# EAGLE design k22a (EAGLE 6.5.0)

## Sheet 1 of 2
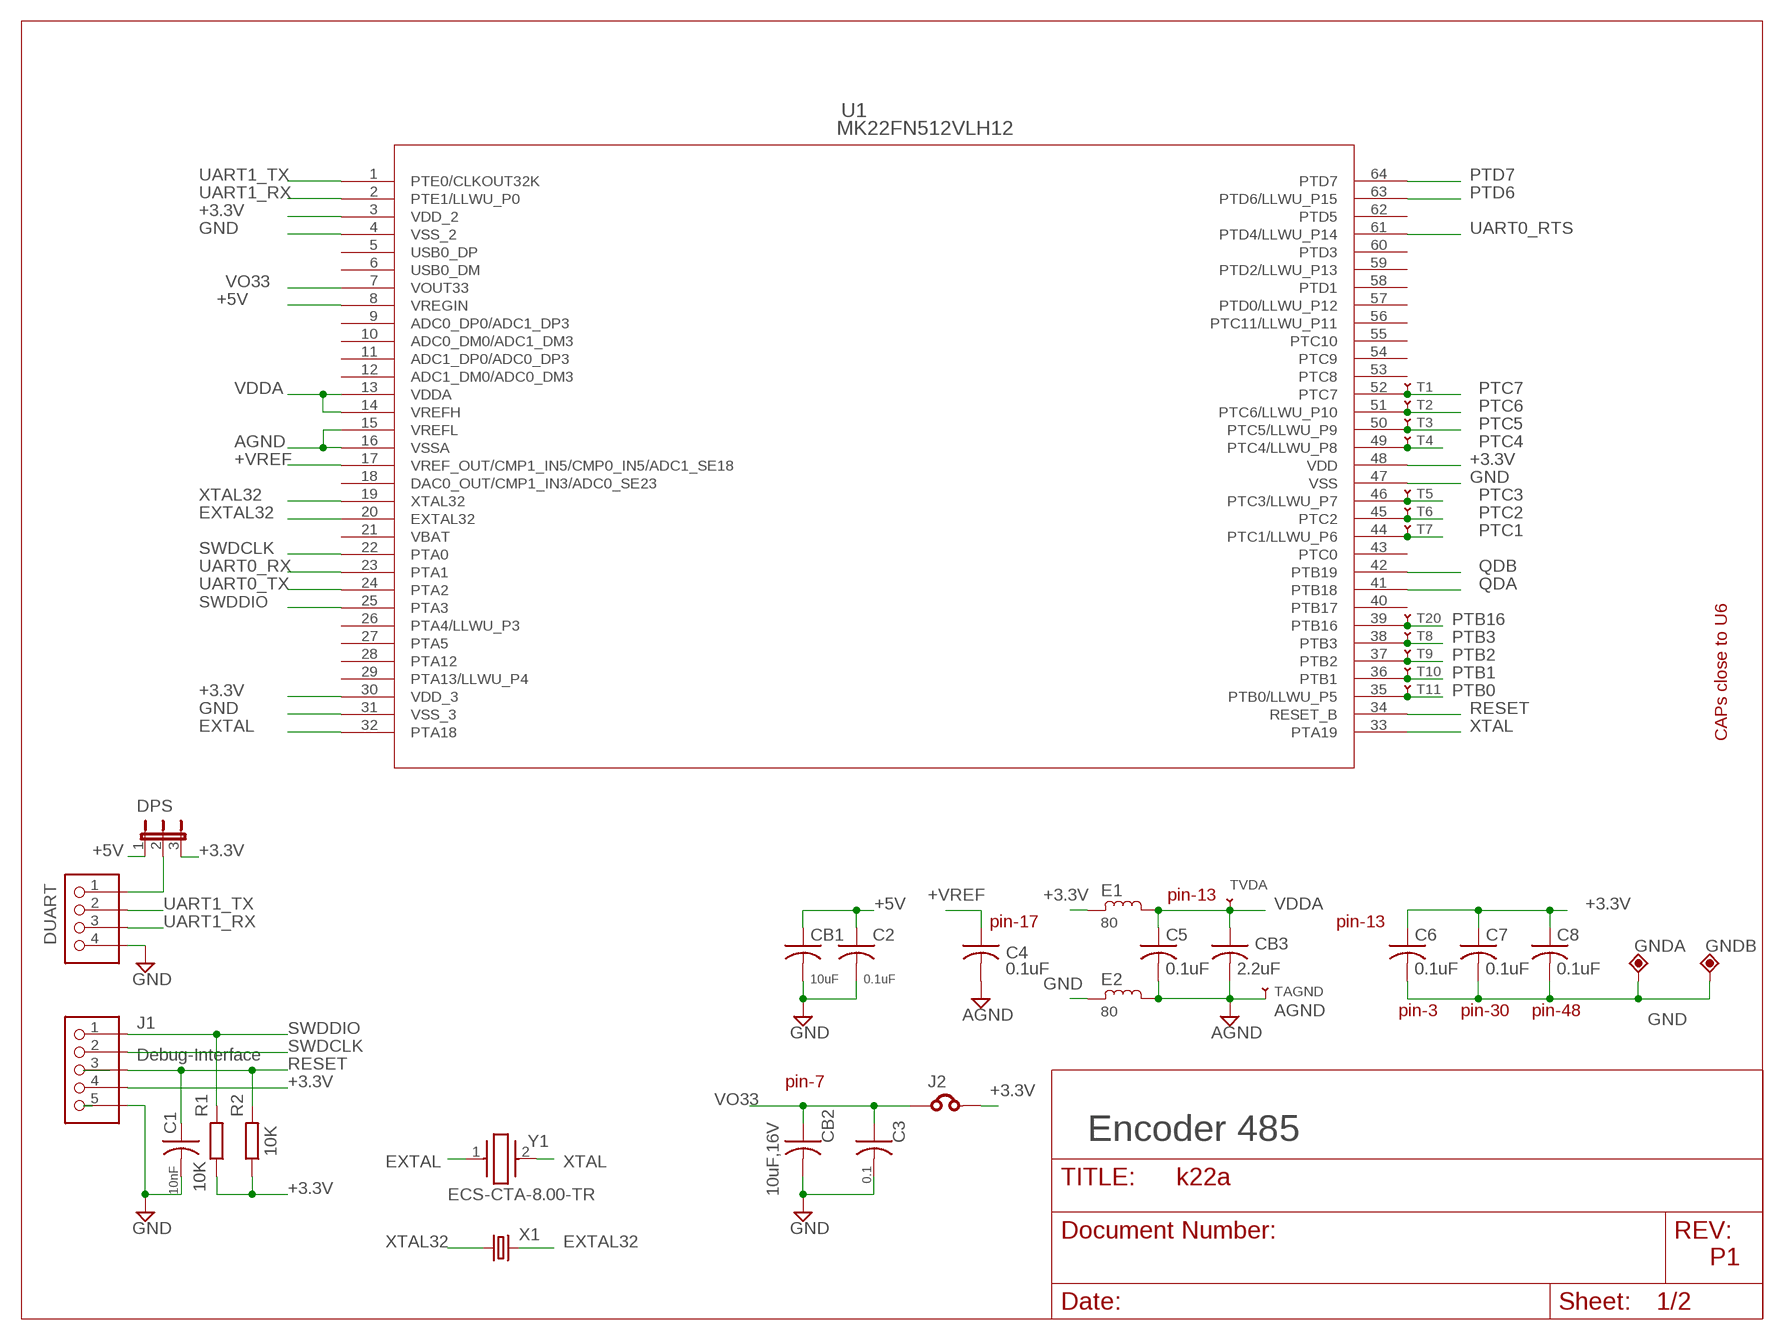
[diagram p0: schematic, sheet 1]

### Parts
C1  10nF  C-USC1206  [C1206]
C2  0.1uF  C-USC1206  [C1206]
C3  0.1  C-USC1206  [C1206]
C4  0.1uF  C-USC1206  [C1206]
C5  0.1uF  C-USC1206  [C1206]
C6  0.1uF  C-USC1206  [C1206]
C7  0.1uF  C-USC1206  [C1206]
C8  0.1uF  C-USC1206  [C1206]
CB1  10uF  C-USC1206  [C1206]
CB2  10uF,16V  C-USC1206  [C1206]
CB3  2.2uF  C-USC1206  [C1206]
DPS  JP2E-0805  [R0805/2]
DUART  PINHD-1X4  [1X4]
E1  80  ELDRC25SMD  [M1206]
E2  80  ELDRC25SMD  [M1206]
GNDA  TPP-PAD-032  [PAD-032]
GNDB  TPP-PAD-032  [PAD-032]
J1  PINHD-1X52MM  [1X5_2MM]
J2  J0805  [R0805]
R1  10K  R-EU_M1206  [M1206]
R2  10K  R-EU_M1206  [M1206]
T1  ATP-40  [ATP-40]
T2  ATP-40  [ATP-40]
T3  ATP-40  [ATP-40]
T4  ATP-40  [ATP-40]
T5  ATP-40  [ATP-40]
T6  ATP-40  [ATP-40]
T7  ATP-40  [ATP-40]
T8  ATP-40  [ATP-40]
T9  ATP-40  [ATP-40]
T10  ATP-40  [ATP-40]
T11  ATP-40  [ATP-40]
T20  ATP-40  [ATP-40]
TAGND  ATP-40  [ATP-40]
TVDA  ATP-40  [ATP-40]
U1  MK22FN512VLH12  [LQFP-64_10X10X1.6]
X1  CRYSTALTC26V  [TC26V@1]
Y1  ECS-CTA-8.00-TR  [ECSCTA800TR]

### Nets
+3.3V: C6.1 C7.1 C8.1 DPS.3 E1.1 J1.4 J2.2 R1.1 R2.1 U1.3(VDD_2) U1.30(VDD_3) U1.48(VDD) ; also sheet 2
+5V: C2.1 CB1.1 DPS.1 U1.8(VREGIN) ; also sheet 2
+VREF: C4.1 U1.17(VREF_OUT/CMP1_IN5/CMP0_IN5/ADC1_SE18)
AGND: C4.2 C5.2 CB3.2 E2.2 TAGND.P(TP) U1.15(VREFL) U1.16(VSSA)
EXTAL: U1.32(PTA18) Y1.1
EXTAL32: U1.20(EXTAL32) X1.2
GND: C1.2 C2.2 C3.2 C6.2 C7.2 C8.2 CB1.2 CB2.2 DUART.4 E2.1 GNDA.1(TP) GNDB.1(TP) J1.5 U1.4(VSS_2) U1.31(VSS_3) U1.47(VSS) ; also sheet 2
N$5: DPS.2 DUART.1
PTB0: T11.P(TP) U1.35(PTB0/LLWU_P5)
PTB1: T10.P(TP) U1.36(PTB1)
PTB2: T9.P(TP) U1.37(PTB2)
PTB3: T8.P(TP) U1.38(PTB3)
PTB16: T20.P(TP) U1.39(PTB16)
PTC1: T7.P(TP) U1.44(PTC1/LLWU_P6)
PTC2: T6.P(TP) U1.45(PTC2)
PTC3: T5.P(TP) U1.46(PTC3/LLWU_P7)
PTC4: T4.P(TP) U1.49(PTC4/LLWU_P8)
PTC5: T3.P(TP) U1.50(PTC5/LLWU_P9)
PTC6: T2.P(TP) U1.51(PTC6/LLWU_P10)
PTC7: T1.P(TP) U1.52(PTC7)
PTD6: U1.63(PTD6/LLWU_P15) ; also sheet 2
PTD7: U1.64(PTD7) ; also sheet 2
QDA: U1.41(PTB18) ; also sheet 2
QDB: U1.42(PTB19) ; also sheet 2
RESET: C1.1 J1.3 R2.2 U1.34(RESET_B) ; also sheet 2
SWDCLK: J1.2 U1.22(PTA0) ; also sheet 2
SWDDIO: J1.1 R1.2 U1.25(PTA3) ; also sheet 2
UART0_RTS: U1.61(PTD4/LLWU_P14) ; also sheet 2
UART0_RX: U1.23(PTA1) ; also sheet 2
UART0_TX: U1.24(PTA2) ; also sheet 2
UART1_RX: DUART.3 U1.2(PTE1/LLWU_P0)
UART1_TX: DUART.2 U1.1(PTE0/CLKOUT32K)
VDDA: C5.1 CB3.1 E1.2 TVDA.P(TP) U1.13(VDDA) U1.14(VREFH)
VO33: C3.1 CB2.1 J2.1 U1.7(VOUT33)
XTAL: U1.33(PTA19) Y1.2
XTAL32: U1.19(XTAL32) X1.1
Unconnected: U1.5(USB0_DP) U1.6(USB0_DM) U1.9(ADC0_DP0/ADC1_DP3) U1.10(ADC0_DM0/ADC1_DM3) U1.11(ADC1_DP0/ADC0_DP3) U1.12(ADC1_DM0/ADC0_DM3) U1.18(DAC0_OUT/CMP1_IN3/ADC0_SE23) U1.26(PTA4/LLWU_P3) U1.27(PTA5) U1.28(PTA12) U1.29(PTA13/LLWU_P4) U1.40(PTB17) U1.43(PTC0) U1.53(PTC8) U1.54(PTC9) U1.55(PTC10) U1.56(PTC11/LLWU_P11) U1.57(PTD0/LLWU_P12) U1.58(PTD1) U1.59(PTD2/LLWU_P13) U1.60(PTD3) U1.62(PTD5)

### Notes on the sheet
- CAPs close to U6
- pin-13
- pin-17 | pin-13
- pin-3 | pin-30 | pin-48
- Debug-Interface
- pin-7
- Encoder 485
- P1

## Sheet 2 of 2
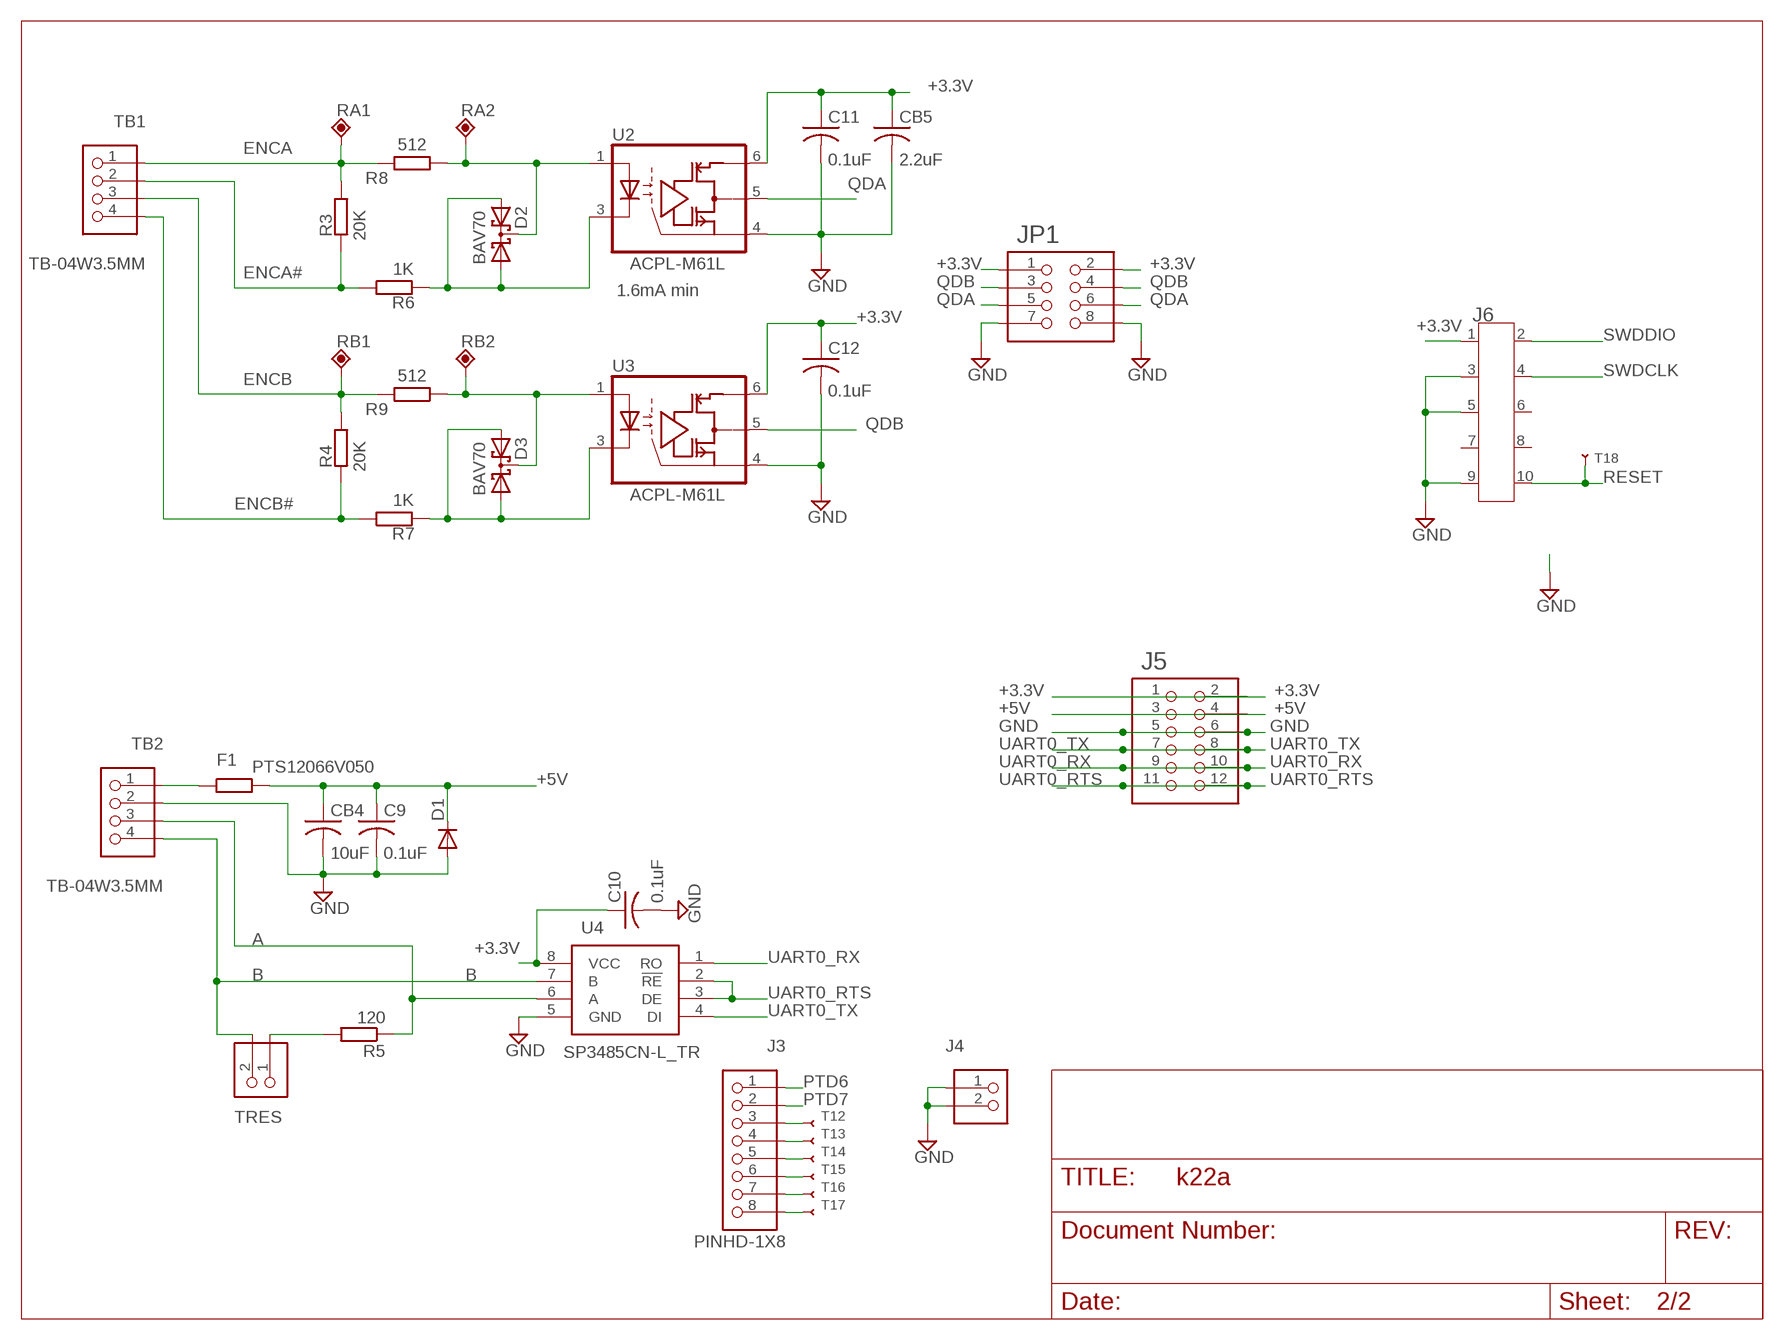
[diagram p1: schematic, sheet 2]

### Parts
C9  0.1uF  C-USC1206  [C1206]
C10  0.1uF  C-USC1206  [C1206]
C11  0.1uF  C-USC1206  [C1206]
C12  0.1uF  C-USC1206  [C1206]
CB4  10uF  C-USC1206  [C1206]
CB5  2.2uF  C-USC1206  [C1206]
D1  DIODE-DO214AC  [DO214AC]
D2  BAV70  BAS70-05  [SOT23]
D3  BAV70  BAS70-05  [SOT23]
F1  PTS12066V050  R-EU_R1206  [R1206]
J3  PINHD-1X8  [1X8]
J4  PINHD-1X2  [1X2]
J5  PINHD-2X6  [2X6]
J6  FTSH-105-01-L-DVMH  [CON10_2X5_FTSH_1]
JP1  PINHD-2X4  [2X4]
R3  20K  R-EU_M1206  [M1206]
R4  20K  R-EU_M1206  [M1206]
R5  120  R-EU_M0805  [M0805]
R6  1K  R-EU_M1206  [M1206]
R7  1K  R-EU_M1206  [M1206]
R8  512  R-EU_M1206  [M1206]
R9  512  R-EU_M1206  [M1206]
RA1  TPP-PAD-032  [PAD-032]
RA2  TPP-PAD-032  [PAD-032]
RB1  TPP-PAD-032  [PAD-032]
RB2  TPP-PAD-032  [PAD-032]
T12  ATP-40  [ATP-40]
T13  ATP-40  [ATP-40]
T14  ATP-40  [ATP-40]
T15  ATP-40  [ATP-40]
T16  ATP-40  [ATP-40]
T17  ATP-40  [ATP-40]
T18  ATP-40  [ATP-40]
TB1  TB-04W3.5MM  [WURTH35-04]
TB2  TB-04W3.5MM  [WURTH35-04]
TRES  PINHD-1X2  [1X2]
U2  ACPL-M61L  ACPL-M61LSO5  [SO-5]
U3  ACPL-M61L  ACPL-M61LSO5  [SO-5]
U4  SP3485CN-L_TR  [SOIC127P600X175-8N]

### Nets
+3.3V: C10.1 C11.1 C12.1 CB5.1 J5.1 J5.2 J6.1 JP1.1 JP1.2 U2.6(VCC) U3.6(VCC) U4.8(VCC) ; also sheet 1
+5V: C9.1 CB4.1 D1.C F1.2 J5.3 J5.4 ; also sheet 1
A: R5.1 TB2.3 U4.6(A)
B: TB2.4 TRES.2 U4.7(B)
ENCA: R3.1 R8.2 RA1.1(TP) TB1.1
ENCA#: R3.2 R6.1 TB1.2
ENCB: R4.1 R9.2 RB1.1(TP) TB1.3
ENCB#: R4.2 R7.1 TB1.4
GND: C9.2 C10.2 C11.2 C12.2 CB4.2 CB5.2 D1.A J4.1 J4.2 J5.5 J5.6 J6.3 J6.5 J6.9 JP1.7 JP1.8 TB2.2 U2.4(GND) U3.4(GND) U4.5(GND) ; also sheet 1
N$1: D3.3(C) R9.1 RB2.1(TP) U3.1(A)
N$2: D2.1(A1) D2.2(A2) R6.2 U2.3(C)
N$3: D2.3(C) R8.1 RA2.1(TP) U2.1(A)
N$4: D3.1(A1) D3.2(A2) R7.2 U3.3(C)
N$6: F1.1 TB2.1
N$8: J3.3 T12.P(TP)
N$9: J3.4 T13.P(TP)
N$10: J3.5 T14.P(TP)
N$11: R5.2 TRES.1
N$12: J3.6 T15.P(TP)
N$13: J3.7 T16.P(TP)
N$14: J3.8 T17.P(TP)
PTD6: J3.1 ; also sheet 1
PTD7: J3.2 ; also sheet 1
QDA: JP1.5 JP1.6 U2.5(OUT) ; also sheet 1
QDB: JP1.3 JP1.4 U3.5(OUT) ; also sheet 1
RESET: J6.10 T18.P(TP) ; also sheet 1
SWDCLK: J6.4 ; also sheet 1
SWDDIO: J6.2 ; also sheet 1
UART0_RTS: J5.11 J5.12 U4.2(!RE) U4.3(DE) ; also sheet 1
UART0_RX: J5.9 J5.10 U4.1(RO) ; also sheet 1
UART0_TX: J5.7 J5.8 U4.4(DI) ; also sheet 1
Unconnected: J6.6 J6.7 J6.8

### Notes on the sheet
- 1.6mA min

## Power pins joined to a net without a drawn wire
VBAT: U1.21(VBAT)

## Library data of the parts
C1-C12 CB1-CB5 = rcl:C-US: CAPACITOR, American symbol
D1 = diode:DIODE-: DIODE
D2 D3 = diode:BAS70-05: Silicon Schottky Diodes General-purpose diode for high-speed switching; PARTNO: BAV70-7-F
DPS = jumper:JP2E: JUMPER
DUART = stanley:PINHD-1X4
E1 E2 = stanley:ELDRC25
F1 R1-R4 R6-R9 = rcl:R-EU_: RESISTOR, European symbol
GNDA GNDB RA1 RA2 RB1 RB2 = testpoint:TPP: TEST POINT PAD
J1 = stanley:PINHD-1X5
J2 = jumper:J: Jumper/Bridge
J3 = stanley:PINHD-1X8
J4 TRES = stanley:PINHD-1X2
J5 = scia:PINHD-2X6
J6 = stanley:FTSH-105-01-L-DV: Use for minimum footprint (hot air flow)
JP1 = scia:PINHD-2X4
R5 = rcl:R-EU_: RESISTOR, European symbol; PARTNO: RC0805FR-072K7L
T1-T18 T20 TAGND TVDA = testpoint:ATP: AUTOMATED TEST POINT for automated bed of nails machinery; BOM: EXCLUDE
TB1 TB2 = stanley:TB-04
U1 = MK22FN512VHL12:MK22FN512VLH12; CPU: ARM Cortex-M4F; FLASHKB: 512; MANUFACTURER_PART_NUMBER: mk22fn512vlh12; MAXFREQUENCY: 120; PINCOUNT: 64; SRAMKB: 128; VENDOR: FREESCALE
U2 U3 = wcc:ACPL-M61L; PARTNO: ACPL-M61L-000E
U4 = SP3485CN-L_TR:SP3485CN-L_TR: RS-485 Interface IC 3.3V LoPwr Half-Dup RS485w/10Mbps Data Source: Datasheet <https://datasheet.datasheetarchive.com/originals/distributors/DKDS42/DSANUWW0043527.pdf>; ARROW_PART_NUMBER: SP3485CN-L/TR; ARROW_PRICE-STOCK: https://www.arrow.com/en/products/sp3485cn-ltr/maxlinear-inc?region=nac; DESCRIPTION: RS-485 Interface IC 3.3V LoPwr Half-Dup RS485w/10Mbps Data; HEIGHT: 1.75mm; MANUFACTURER_NAME: MaxLinear, Inc.; MANUFACTURER_PART_NUMBER: SP3485CN-L/TR; MOUSER_PART_NUMBER: 701-SP3485CN-L/TR; MOUSER_PRICE-STOCK: https://www.mouser.co.uk/ProductDetail/MaxLinear/SP3485CN-L-TR?qs=3EMgrMjM0fZL2ArUMUL9Gg%3D%3D
X1 = crystal:CRYSTAL: CRYSTAL; OC_FARNELL: unknown; OC_NEWARK: unknown
Y1 = ECS-CTA-8.00-TR:ECS-CTA-8.00-TR: 8 MHz Ceramic Resonator Without Capacitor +/-0.2% 30 Ohms -25C ~ 85C Surface Mount Source: Datasheet <https://ecsxtal.com/store/pdf/ECS-CTA.pdf>; DESCRIPTION: 8 MHz Ceramic Resonator Without Capacitor +/-0.2% 30 Ohms -25C ~ 85C Surface Mount; HEIGHT: 1.7mm; MANUFACTURER_NAME: ECS; MANUFACTURER_PART_NUMBER: ECS-CTA-8.00-TR

## Board
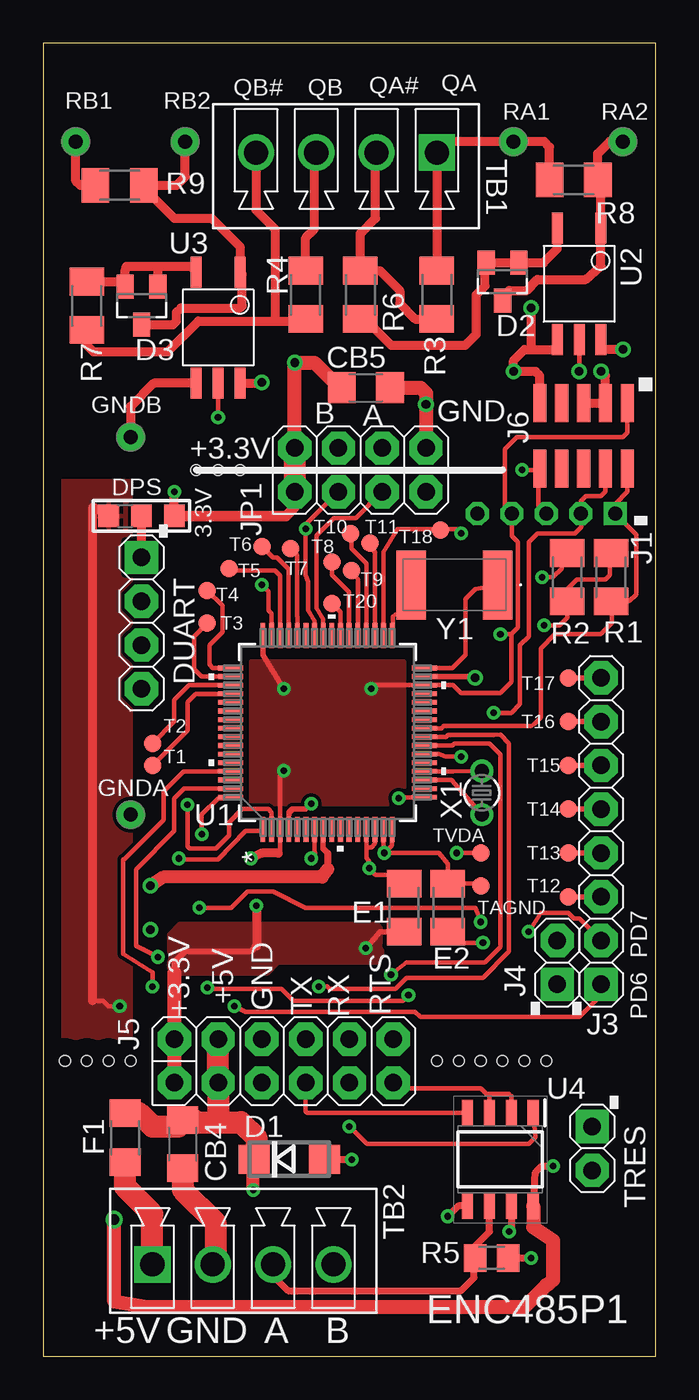
[diagram p2: board, top side]
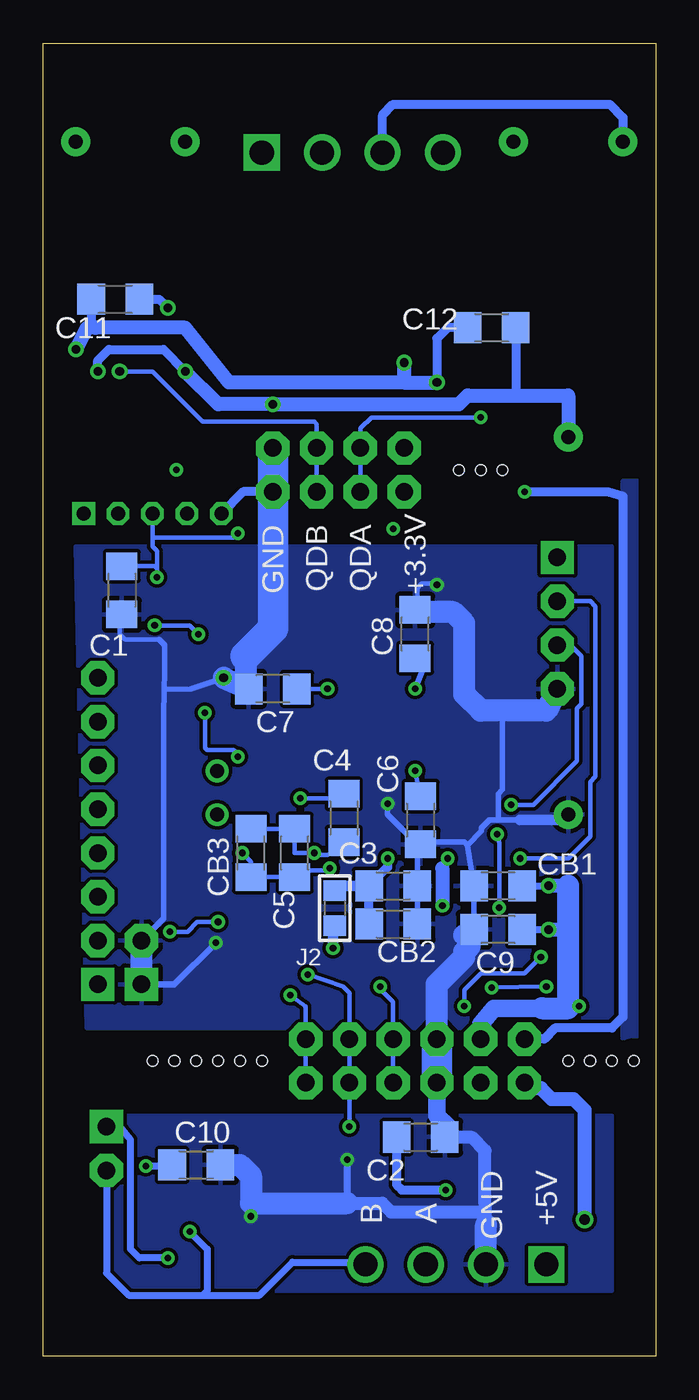
[diagram p3: board, bottom side, seen from below]

Size 35.56 x 76.2 mm. Coordinates in mm from the lower left corner, seen from the top.
Outline: 0,0 35.56,0 35.56,76.2 0,76.2 0,0
Copper layers (1*16): Top 0.035mm / dielectric 1.5mm / Bottom 0.035mm
Design rules "default *": minimum track width 10mil, minimum drill 15mil, track to track 8mil, track to pad 8mil, pad to pad 8mil, via to via 8mil, smd to smd 8mil, copper to edge 40mil, drill to drill 8mil, minimum pad ring 10mil, minimum via ring 8mil, stop-mask expansion 4mil, vias tented up to drill 0mil, thermal gap 10mil
Holes 0.6 mm at 5.08,17.14 3.81,17.14 2.54,17.14 1.27,17.14 22.86,17.14 24.13,17.14 25.4,17.14 26.67,17.14 27.94,17.14 29.21,17.14 10.16,51.44 11.43,51.44 8.89,51.44

### Footprints (pad centres in the part's own frame; a part is rotated, then mirrored left to right if it is on the bottom)
C1206 = smd 1.6 x 1.8: 1 -1.4,0; 2 1.4,0
DO214AC = smd 1.8 x 1.7: A 2.05,0; C -2.05,0
SOT23 = smd 1 x 1.4: 1 -0.95,-1.1; 2 0.95,-1.1; 3 0,1.1
R0805/2 = smd 1.2 x 1.3: 1 -1.905,0; 2 0,0; 3 1.905,0
1X4 = drill 1.016 pad 1.93 square: 1 -3.81,0 | drill 1.016 pad 1.93 octagon: 2 -1.27,0; 3 1.27,0; 4 3.81,0
M1206 = smd 1.6 x 2: 1 -1.4,0; 2 1.4,0
R1206 = smd 1.6 x 1.803: 1 -1.422,0; 2 1.422,0
PAD-032 = drill 0.813 pad 1.676: 1 0,0
1X5_2MM = drill 0.813 square: 1 -4,0 | drill 0.813 octagon: 2 -2,0; 3 0,0; 4 2,0; 5 4,0
R0805 = smd 1.2 x 1.3: 1 -1.016,0; 2 1.016,0
1X8 = drill 1.016 pad 1.93 square: 1 -8.89,0 | drill 1.016 pad 1.93 octagon: 2 -6.35,0; 3 -3.81,0; 4 -1.27,0; 5 1.27,0; 6 3.81,0; 7 6.35,0; 8 8.89,0
1X2 = drill 1.016 pad 1.93 square: 1 -1.27,0 | drill 1.016 pad 1.93 octagon: 2 1.27,0
2X6 = drill 1.016 pad 1.93 octagon: 1 -6.35,-1.27; 2 -6.35,1.27; 3 -3.81,-1.27; 4 -3.81,1.27; 5 -1.27,-1.27; 6 -1.27,1.27; 7 1.27,-1.27; 8 1.27,1.27; 9 3.81,-1.27; 10 3.81,1.27; 11 6.35,-1.27; 12 6.35,1.27
CON10_2X5_FTSH_1 = smd 0.762 x 2.2: 1 -2.54,-1.9; 2 -2.54,1.9; 3 -1.27,-1.9; 4 -1.27,1.9; 5 0,-1.9; 6 0,1.9; 7 1.27,-1.9; 8 1.27,1.9; 9 2.54,-1.9; 10 2.54,1.9
2X4 = drill 1.016 pad 1.93 octagon: 1 -3.81,-1.27; 2 -3.81,1.27; 3 -1.27,-1.27; 4 -1.27,1.27; 5 1.27,-1.27; 6 1.27,1.27; 7 3.81,-1.27; 8 3.81,1.27
M0805 = smd 1.3 x 1.6: 1 -0.95,0; 2 0.95,0
ATP-40 = smd 1.016 x 1.016: P 0,0
WURTH35-04 = drill 1.4 square: 1 -0.005,0 | drill 1.4: 2 3.5,0; 3 7,0; 4 10.5,0
LQFP-64_10X10X1.6 = smd 1.461 x 0.27: 1 -5.625,3.75; 2 -5.625,3.25; 3 -5.625,2.75; 4 -5.625,2.25; 5 -5.625,1.75; 6 -5.625,1.25; 7 -5.625,0.75; 8 -5.625,0.25; 9 -5.625,-0.25; 10 -5.625,-0.75; 11 -5.625,-1.25; 12 -5.625,-1.75; 13 -5.625,-2.25; 14 -5.625,-2.75; 15 -5.625,-3.25; 16 -5.625,-3.75; 33 5.625,-3.75; 34 5.625,-3.25; 35 5.625,-2.75; 36 5.625,-2.25; 37 5.625,-1.75; 38 5.625,-1.25; 39 5.625,-0.75; 40 5.625,-0.25; 41 5.625,0.25; 42 5.625,0.75; 43 5.625,1.25; 44 5.625,1.75; 45 5.625,2.25; 46 5.625,2.75; 47 5.625,3.25; 48 5.625,3.75 | smd 0.27 x 1.461: 17 -3.75,-5.625; 18 -3.25,-5.625; 19 -2.75,-5.625; 20 -2.25,-5.625; 21 -1.75,-5.625; 22 -1.25,-5.625; 23 -0.75,-5.625; 24 -0.25,-5.625; 25 0.25,-5.625; 26 0.75,-5.625; 27 1.25,-5.625; 28 1.75,-5.625; 29 2.25,-5.625; 30 2.75,-5.625; 31 3.25,-5.625; 32 3.75,-5.625; 49 3.75,5.625; 50 3.25,5.625; 51 2.75,5.625; 52 2.25,5.625; 53 1.75,5.625; 54 1.25,5.625; 55 0.75,5.625; 56 0.25,5.625; 57 -0.25,5.625; 58 -0.75,5.625; 59 -1.25,5.625; 60 -1.75,5.625; 61 -2.25,5.625; 62 -2.75,5.625; 63 -3.25,5.625; 64 -3.75,5.625
SO-5 = smd 1.803 x 0.635: 1 -3.226,1.27; 3 -3.226,-1.27; 4 3.226,-1.27; 5 3.226,0; 6 3.226,1.27
SOIC127P600X175-8N = smd 1.5 x 0.65: 1 -2.7,1.905; 2 -2.7,0.635; 3 -2.7,-0.635; 4 -2.7,-1.905; 5 2.7,-1.905; 6 2.7,-0.635; 7 2.7,0.635; 8 2.7,1.905
TC26V@1 = drill 0.813: 1 -1.27,0; 2 1.27,0
ECSCTA800TR = smd 1.7 x 4: 1 -2.5,0; 2 2.5,0

### Placement (x,y rotation side)
C1  30.99,44.45 270 bottom
C2  13.64,12.73 0 bottom
C3  15.24,27.3 0 bottom
C4  18.1,31.24 270 bottom
C5  20.95,29.21 90 bottom
C6  13.65,31.11 270 bottom
C7  22.23,38.73 180 bottom
C8  13.97,41.91 90 bottom
C9  9.14,24.77 180 bottom
C10  26.67,11.11 0 bottom
C11  31.37,61.34 0 bottom
C12  9.53,59.69 0 bottom
CB1  9.14,27.3 180 bottom
CB2  15.24,25.08 0 bottom
CB3  23.5,29.21 90 bottom
CB4  8.1,12.32 270 top
CB5  18.73,56.2 0 top
D1  14.29,11.43 0 top
D2  26.67,62.36 180 top
D3  5.71,60.96 180 top
DPS  5.71,48.77 0 top
DUART  5.71,42.55 270 top
E1  20.95,26.04 90 top
E2  23.5,26.04 90 top
F1  4.76,12.7 90 top
GNDA  5.08,31.43 0 top
GNDB  5.08,53.34 0 top
J1  29.21,48.9 180 top
J2  18.63,26.01 270 bottom
J3  32.38,30.48 90 top
J4  29.84,22.86 90 top
J5  13.97,17.14 0 top
J6  31.37,53.4 180 top
JP1  18.41,51.44 0 top
R1  32.96,45.21 270 top
R2  30.42,45.21 90 top
R3  22.86,61.59 270 top
R4  15.24,61.59 270 top
R5  26.04,5.71 0 top
R6  18.41,61.59 270 top
R7  2.54,60.96 90 top
R8  30.8,68.26 180 top
R9  4.45,67.94 180 top
RA1  27.3,70.48 0 top
RA2  33.66,70.48 0 top
RB1  1.91,70.48 0 top
RB2  8.26,70.48 0 top
T1  6.35,34.29 0 top
T2  6.35,35.56 0 top
T3  9.53,42.55 0 top
T4  9.53,44.45 0 top
T5  10.79,45.72 0 top
T6  12.7,46.99 0 top
T7  14.35,46.86 0 top
T8  16.76,46.1 0 top
T9  17.91,45.59 0 top
T10  17.84,47.75 0 top
T11  18.99,47.18 0 top
T12  30.48,26.67 0 top
T13  30.48,29.21 0 top
T14  30.48,31.75 0 top
T15  30.48,34.29 0 top
T16  30.48,36.83 0 top
T17  30.48,39.37 0 top
T18  23.05,47.94 0 top
T20  16.76,43.69 0 top
TAGND  25.4,27.3 0 top
TB1  22.86,69.85 180 top
TB2  6.35,5.33 0 top
TRES  31.88,12.06 270 top
TVDA  25.4,29.21 0 top
U1  16.51,36.2 90 top
U2  31.11,62.23 270 top
U3  10.16,59.69 270 top
U4  26.54,11.43 270 top
X1  25.46,32.7 90 top
Y1  23.88,44.77 180 top

### Tracks (layer width: path | path; a pad name or v marks a point on that pad's centre or on a via)
+3.3V  (via drill 0.38, 0.5, 0.6)
  Top 0.254: v19.05,38.73 19.26,38.95 U1.30 23.79,38.95 24.26,38.48 26.54,38.48 27.18,39.12 27.18,41.91 | v13.97,33.97 13.76,33.76 U1.3 13.76,29.32 13.65,29.21 | 27.18,41.91 27.56,42.29 27.56,47.24 27.21,47.59 J1.4 26.8,49.31 26.8,52.64 27.5,53.34 33.66,53.34 33.91,53.59 J6.1 | R1.1 32.89,46.55 32.89,45.34 32.64,45.09 30.99,45.09 30.42,44.51 R2.1 30.42,42.86 29.97,42.42 v29.08,42.42 | v26.54,41.91 27.18,41.91
  Top 0.305: U1.48 12.76,40.7 v13.97,38.73 | 12.38,23.81 12.06,23.5 8.26,23.5 7.62,22.86 7.62,22.23 | E1.1 19.55,24.64 v18.73,23.69
  Top 0.406: U4.8 28.57,10.67 28.96,11.05 v29.59,11.05
  Top 0.508: 13.65,29.21 12.7,29.21 v12.06,28.89 | v12.38,26.16 12.38,23.81 | DPS.3 v7.62,50.16 | v33.66,58.42 32.38,58.42 U2.6 | U3.6 12.65,56.46 v12.7,56.52
  Top 0.61: JP1.1 14.61,49.28 14.1,48.77 DPS.3
  Top 0.813: 7.62,22.23 J5.2 J5.1 | U4.8 28.45,7.49 29.59,6.73 29.59,4.45 29.34,4.19 29.21,4.13 27.94,2.86 6.03,2.86 4.13,3.17 v4.13,7.94 | JP1.2 v14.61,57.66 15.75,57.66 17.02,56.39 17.02,55.88 CB5.1
  Top 1.27: JP1.2 JP1.1
  Bottom 0.254: v19.05,38.73 C7.1 | v13.97,33.97 C6.1 | v29.08,42.42 27.05,42.42 v26.54,41.91
  Bottom 0.305: v13.97,38.73 13.46,40.01 C8.1 | 18.73,25.15 J2.2
  Bottom 0.406: v29.59,11.05 28.13,11.05 C10.1
  Bottom 0.508: v12.06,28.89 12.38,28.32 | v7.62,50.16 2.79,50.16 1.91,49.91 1.91,19.68 2.54,19.05 5.84,19.05 6.48,18.41 J5.2 | C11.1 32.77,59.69 32.52,59.69 32.51,59.69 | C12.1 12.06,59.69 12.7,59.05 v12.7,56.52
  Bottom 0.61: v18.73,23.69 18.73,25.15
  Bottom 0.813: v4.13,7.94 4.13,14.29 4.76,14.92 6.03,14.92 6.67,15.56 7.3,15.56 J5.1 | 12.38,28.32 v12.38,26.16 | v14.61,57.66 14.61,56.52 | 14.61,56.52 v12.7,56.52 | 14.61,56.52 24.77,56.52 27.3,59.69 32.51,59.69 33.02,59.69 v33.66,58.42
  pour Top: 12.06,40.32 20.95,40.32 20.95,32.07 12.06,32.07
  pour Top: 13.65,22.86 19.37,22.86 19.68,23.18 19.68,24.77 19.37,25.08 7.94,25.08 7.3,24.45 7.3,22.54 7.62,22.23 13.02,22.23
  pour Bottom: 0.64,50.8 1.91,50.8 1.91,18.41 0.64,18.41
+5V  (via drill 0.38, 0.5)
  Top 0.254: 2.86,20.64 3.49,20.64 3.81,20.32 v4.45,20.32
  Top 0.305: U1.8 16.26,29.46 16.51,29.21
  Top 0.406: 16.51,29.21 16.51,28.26
  Top 0.508: 2.86,20.64 2.86,49.21 2.92,49.28 DPS.1 | 12.19,11.38 D1.C
  Top 0.762: 16.51,28.26 16.19,27.81 6.99,27.81 v6.22,27.3 | v12.19,9.65 12.19,11.38
  Top 0.813: 7.85,13.34 CB4.1
  Top 1.27: CB4.1 8.76,13.72 8.89,13.59 10.16,13.59 | 10.16,13.59 11.49,13.59 12.38,12.7 12.38,11.57 D1.C | F1.2 5.56,14.12 6.35,13.34 7.85,13.34 | 10.16,13.59 J5.3 J5.4
  Bottom 0.254: 5.08,20.32 v4.45,20.32
  Bottom 0.406: CB1.1 v6.22,27.3 | C9.1 v6.22,24.77
  Bottom 0.508: C2.1 15.04,9.96 14.73,9.65 v12.19,9.65
  Bottom 0.813: 5.08,20.19 5.08,20.32 | v6.22,24.77 5.08,24.77 | 5.08,27.3 v6.22,27.3
  Bottom 1.016: J5.4 10.16,19.3 9.4,20.19 6.6,20.19
  Bottom 1.27: 6.6,20.19 5.08,20.19 | 5.08,20.32 5.08,24.77 5.08,27.3
  pour Top: 0.76,50.8 5.08,50.8 5.08,17.78 0.76,17.78 0.95,46.35
+VREF  (via drill 0.38)
  Top 0.254: U1.17 21.02,32.45 v20.64,32.38
  Bottom 0.254: v20.64,32.38 18.23,32.38 C4.1
A
  Top 0.406: TB2.3 13.35,4.68 14.22,3.81 24.26,3.81 25.02,4.57 25.02,5.65 R5.1 25.09,6.42 25.91,7.24 U4.6
AGND  (via drill 0.38)
  Top 0.254: U1.16 20.26,29.66 v19.81,29.21 | U1.15 19.76,29.16 v19.81,29.21 | v19.81,29.21 22.99,29.21 23.5,28.57 E2.2 25.27,27.43 TAGND.P
  Bottom 0.254: C4.2 19.05,29.08 19.43,29.08 19.56,29.21 v19.81,29.21 20.95,29.21 C5.2 CB3.2
B  (via drill 0.38)
  Top 0.406: U4.7 27.18,7.49 v27.05,7.24
  Bottom 0.406: TRES.2 31.88,4.83 30.61,3.56 26.29,3.56 | 26.29,3.56 22.99,3.56 21.08,5.46 16.98,5.46 TB2.4 | v27.05,7.24 26.04,6.22 26.04,3.81 26.29,3.56
ENCA
  Top 0.508: R8.2 29.4,70.17 29.08,70.48 RA1.1 23.5,70.48 TB1.1 R3.1
ENCA#
  Top 0.508: R3.2 21.59,60.2 20.7,61.09 20.7,61.85 19.55,62.99 R6.1 18.41,65.15 19.3,66.04 19.3,69.79 TB1.2
ENCB
  Top 0.508: R4.1 15.24,64.9 15.75,65.41 15.75,69.74 TB1.3 | R9.2 2.16,67.94 1.91,68.2 RB1.1
  Bottom 0.508: TB1.3 15.86,72.02 15.24,72.64 2.67,72.64 1.91,71.88 RB1.1
ENCB#
  Top 0.508: TB1.4 12.36,66.51 13.46,65.41 13.46,60.07 | R4.2 15.12,60.07 13.46,60.07 | R7.1 2.54,58.67 2.92,58.29 7.24,58.29 9.02,60.07 13.46,60.07
EXTAL
  Top 0.254: U1.32 23.75,39.95 24.51,40.7 24.51,43.94 25.08,44.51 Y1.1
EXTAL32
  Top 0.254: U1.20 23.79,33.95 X1.2
GND  (via drill 0.38, 0.5)
  Top 0.254: U1.4 14.26,31.41 14.29,31.43 | U1.47 13.26,43.1 13.08,43.28 13.08,44.39 v12.7,44.77 | v25.53,24 24.13,24 E2.1
  Top 0.305: U1.31 25.01,39.45 v25.08,39.37 | 14.29,31.43 14.29,31.56 14.48,31.75 15.24,31.75 v15.56,32.07
  Top 0.406: U4.5 24.1,8.73 v23.5,8.13 | D1.A v17.91,11.43
  Top 0.508: 28.32,58.42 27.94,58.42 27.3,57.78 v27.3,57.15 28.57,57.15 28.83,56.9 J6.9 | 28.32,58.42 29.84,58.42 U2.4 | v32.38,57.15 32.64,56.9 J6.3 J6.5 | v28.32,60.83 28.32,58.42 | U3.4 6.43,56.46 5.08,55.12 GNDB.1
  Top 0.813: CB5.2 21.91,56.2 22.23,55.88 v22.23,55.24 JP1.8
  Top 1.27: CB4.2 8.1,9.68 10,7.78 10,5.23 TB2.2
  Bottom 0.254: 13.84,43.18 13.84,44.58 13.59,44.83 12.76,44.83 v12.7,44.77 | 28.83,41.59 30.8,41.59 31.11,41.91 31.11,42.92 C1.2
  Bottom 0.305: J4.2 28.57,25.4 28.57,37.15 28.54,38.7 | 28.54,38.7 26.99,38.73 v25.08,39.37 | C6.2 13.84,29.71 15.56,31.43 v15.56,32.07 | 10.93,29.66 CB1.2 C9.2 11.11,24.58 11.11,24.45 | 10.93,29.66 11.11,29.84 13.52,29.84 C6.2 | 7.88,31.11 9.14,31.11 | 9.14,31.11 9.65,31.11 10.11,30.66 10.11,30.48 10.93,29.66 | 6.35,37.47 8.57,37.47 8.89,37.15 8.89,32.89 9.14,32.64 9.14,31.11 | 28.83,41.59 28.51,41.27 28.51,39.69 28.54,38.7 | CB2.2 C3.2 13.84,29.53 C6.2
  Bottom 0.381: v25.53,24 27.94,21.59 J4.1
  Bottom 0.406: v23.5,8.13 23.5,8.89 | v17.91,11.43 17.91,8.89
  Bottom 0.508: JP1.7 23.94,50.16 J1.5 | v32.38,57.15 32.38,57.78 31.75,58.42 28.57,58.42 v27.3,57.15 | C11.2 28.83,61.34 v28.32,60.83 | C12.2 8.12,55.76 8.13,55.75
  Bottom 0.61: 7.88,31.11 6.99,31.11 5.59,31.11 5.21,31.5 GNDA.1
  Bottom 0.762: 9.85,7.63 9.88,8.4 | 9.88,8.4 9.91,9.27 9.91,11.94 10.67,12.7 12.21,12.7 C2.2 | 17.91,8.89 15.88,8.89 15.37,8.38 9.89,8.38 9.88,8.4
  Bottom 0.813: v27.3,57.15 25.4,55.24 v22.23,55.24 11.43,55.24 10.92,55.75 8.13,55.75 5.08,55.75 GNDB.1
  Bottom 1.016: J5.5 12.7,13.97 12.06,13.34 12.06,12.9 C2.2
  Bottom 1.27: TB2.2 9.85,7.63 | 23.81,40.64 23.81,38.92 C7.2 v25.08,39.37 | DUART.4 6.35,37.47 10.16,37.47 11.11,38.42 11.11,42.55 11.75,43.18 13.84,43.18 C8.2 | J4.1 J4.2 | C10.2 24.13,11.11 23.5,10.48 23.5,8.89 17.91,8.89 | J5.6 12.7,21.59 11.11,23.18 11.11,23.5 10.79,23.81 10.79,24.13 11.11,24.45
  Bottom 1.778: J5.5 J5.6 | JP1.8 JP1.7 22.23,42.23 23.81,40.64
  pour Bottom: 33.66,46.99 33.02,19.05 2.54,19.05 2.54,46.99
  pour Bottom: 2.54,13.97 2.54,3.81 33.02,3.81 33.02,13.97
N$1
  Top 0.508: RB2.1 8.26,68.45 7.75,67.94 R9.1 5.84,67.81 7.62,66.04 9.78,66.04 11.43,64.39 U3.1 11.56,62.79 11.56,60.96 11.43,60.83 8,60.83 7.75,60.58 7.75,60.07 7.54,59.86 D3.3
N$2
  Top 0.508: U2.3 29.84,64.26 29.04,63.46 D2.1 D2.2 25.65,63.14 25.65,62.1 25.15,61.59 25.15,59.31 24.51,58.67 20.19,58.67 18.67,60.2 R6.2
N$3
  Top 0.508: D2.3 26.67,61.47 27.05,61.85 28.07,61.85 28.7,62.48 31.5,62.48 32.38,63.25 U2.1 32.38,68.08 R8.1 32.2,69.79 32.89,70.48 RA2.1
N$4
  Top 0.508: D3.1 6.67,63.18 | 6.67,63.18 6.73,63.25 8.56,63.25 U3.3 | D3.2 4.76,62.61 | 4.76,62.61 4.76,63.06 4.83,63.12 4.83,63.25 6.6,63.25 6.67,63.18 | R7.2 4.51,62.36 4.76,62.61
N$5
  Top 0.508: DUART.1 DPS.2
N$6
  Top 1.27: TB2.1 6.34,8.26 4.76,9.84 F1.1
N$8
  Top 0.305: T12.P J3.3
N$9
  Top 0.305: T13.P J3.4
N$10
  Top 0.305: T14.P J3.5
N$11  (via drill 0.38)
  Top 0.406: R5.2 27.37,5.65 27.5,5.65 27.56,5.71 v28.32,5.71
  Bottom 0.406: v28.32,5.71 29.97,5.71 30.48,6.22 30.48,12.57 31.11,13.34 TRES.1
N$12
  Top 0.305: T15.P J3.6
N$13
  Top 0.305: T16.P J3.7
N$14
  Top 0.305: T17.P J3.8
PTB0
  Top 0.254: U1.35 19.26,46.65 T11.P
PTB1
  Top 0.254: 17.91,47.43 T10.P 17.91,47.82 17.91,46.86 18.76,46.01 U1.36
PTB2
  Top 0.254: 17.91,45.47 T9.P 18.29,45.09 18.29,41.85 U1.37
PTB3
  Top 0.254: U1.38 17.76,44.34 16.76,45.34 T8.P
PTB16
  Top 0.254: U1.39 17.26,43.19 T20.P
PTC1
  Top 0.254: U1.44 14.76,42.9 14.73,42.93 14.73,46.48 T7.P
PTC2
  Top 0.254: U1.45 14.26,45.68 13.59,46.35 13.34,46.35 T6.P
PTC3
  Top 0.254: U1.46 13.76,45.3 13.46,45.59 10.92,45.59 T5.P
PTC4
  Top 0.254: U1.49 9.84,39.95 9.65,40.13 9.65,41.27 10.41,42.04 10.41,43.56 T4.P
PTC5
  Top 0.254: U1.50 9.2,39.45 8.76,39.88 8.76,41.78 T3.P
PTC6
  Top 0.254: U1.51 8.46,38.95 7.62,38.1 7.62,36.83 T2.P
PTC7
  Top 0.254: U1.52 8.85,38.45 8.38,37.97 8.38,36.32 T1.P
PTD6  (via drill 0.38)
  Top 0.254: J3.1 32.38,20.95 31.11,19.68 21.91,19.68 21.59,20 11.75,20 v11.11,20.32 | U1.63 8.18,32.95 7.62,32.38 7.62,30.48 5.4,28.26 5.4,23.81 v6.67,23.18
  Bottom 0.254: v11.11,20.32 11.11,21.27 10.16,22.23 7.62,22.23 v6.67,23.18
PTD7  (via drill 0.38)
  Top 0.254: J3.2 31.11,25.4 30.8,25.4 30.48,25.72 28.89,25.72 v28.19,24.64 | v25.4,25.21 25.08,26.04 15.24,26.04 13.34,26.99 11.87,26.99 10.92,26.04 v9.08,26.04 | U1.64 10.82,32.38 10.16,32.38 9.21,31.43 v9.21,30.29
  Bottom 0.254: v28.19,24.64 27.18,24.64 26.61,25.21 v25.4,25.21 | v9.08,26.04 9.08,29.78 v9.21,30.29
QDA  (via drill 0.5)
  Top 0.254: U1.41 16.26,42.8 15.88,43.43 15.88,47.62 16.89,48.64 18.16,48.64 JP1.5 | v31.11,57.15 U2.5
  Bottom 0.254: JP1.5 JP1.6 19.68,54.1 19.81,54.23 26.29,54.23 29.21,57.15 v31.11,57.15
QDB  (via drill 0.38, 0.38 pad 0.25)
  Top 0.254: U1.42 15.75,41.83 15.75,42.67 15.37,43.31 15.37,44.96 15.24,45.34 v15.24,48.01 15.24,48.26 JP1.3 | U3.5 v10.16,54.48
  Bottom 0.254: v10.16,54.48 16.51,54.48 17.14,53.85 JP1.4 JP1.3
RESET  (via drill 0.38)
  Top 0.254: 23.37,48.01 T18.P | v27.81,51.44 28.76,51.44 | 28.76,51.44 J6.10 | v24.26,47.75 24,48.01 23.5,48.01 T18.P | v28.95,45.22 29.59,45.22 30.1,45.72 30.1,46.35 30.35,46.61 R2.2 | 28.76,51.44 28.76,49.34 J1.3 | U1.34 19.76,46.68 20.57,48.01 22.99,48.01 T18.P
  Top 0.406: R2.2 29.97,46.61
  Bottom 0.254: v28.95,45.22 28.95,45.72 | 28.95,45.72 28.95,46.73 29.21,46.99 29.21,47.5 | J1.3 29.21,47.5 | 29.21,47.5 24.51,47.5 v24.26,47.75 | C1.1 29.08,45.85 28.95,45.72
SWDCLK  (via drill 0.38)
  Top 0.254: U1.22 22.97,34.95 23.37,34.8 v24.26,34.8 | J6.4 32.64,50.16 32.38,49.91 31.5,49.91 31.21,49.62 J1.2 31.24,48.86 31.24,48.13 30.86,47.75 28.7,47.75 28.19,47.24 28.19,41.78 27.69,41.27 27.69,37.85 27.18,37.34 v26.16,37.34
  Bottom 0.254: v24.26,34.8 24,34.67 24.51,35.18 26.04,35.18 26.16,35.31 v26.16,37.34
SWDDIO
  Top 0.254: U1.25 23.11,36.45 23.24,36.58 28.32,36.58 28.51,36.7 28.89,37.08 28.89,41.08 29.72,41.91 32.38,41.91 33.02,42.55 33.02,43.75 R1.2 34.04,43.81 34.42,44.2 34.42,47.69 J1.1 33.21,49.47 33.91,50.16 J6.2
UART0_RTS  (via drill 0.38)
  Top 0.254: U1.61 8.16,33.95 6.99,32.77 6.99,31.11 4.7,28.83 4.64,28.83 4.64,23.37 6.35,22.29 v6.35,21.46 | v21.21,20.95 20.89,20.64 14.54,20.64 13.84,21.34 9.59,21.34 v9.53,21.4 | U4.2 27.18,15.11 27.05,15.24 25.78,15.24 | 25.78,15.24 25.72,15.24 25.4,15.56 20.64,15.56 J5.11 | U4.3 25.91,15.11 25.78,15.24
  Bottom 0.254: v6.35,21.46 v9.53,21.4 | v21.21,20.95 20.32,20.32 J5.12 J5.11
UART0_RX  (via drill 0.38)
  Top 0.254: U1.23 23.76,35.45 23.88,35.56 25.91,35.56 26.54,34.92 26.54,23.75 25.65,22.86 21.08,22.86 v20.19,22.16 | U4.1 28.57,12.7 28.19,12.32 18.8,12.32 v17.78,13.34
  Bottom 0.254: v20.19,22.16 18.16,21.46 17.78,21.08 J5.10 J5.9 v17.78,13.34
UART0_TX  (via drill 0.38)
  Top 0.254: U1.24 23.37,35.95 23.5,36.07 26.16,36.07 26.54,36.07 27.05,35.56 27.05,23.5 25.53,21.97 21.08,21.97 20.45,21.34 16.64,21.34 16.51,21.46 v16,21.46 | U4.4 15.33,14.13 15.24,14.22 J5.7
  Bottom 0.254: v16,21.46 16,21.34 15.24,20.57 J5.8 J5.7
UART1_RX  (via drill 0.38)
  Top 0.254: U1.2 13.26,31.57 13.08,31.75 11.56,31.75 10.79,30.99 10.79,30.23 10.03,29.46 8.51,29.46 8.38,29.59 v8.38,32
  Bottom 0.254: v8.38,32 7.11,32 4.57,34.54 4.57,37.59 4.32,37.85 4.32,40.64 4.95,41.27 DUART.3
UART1_TX  (via drill 0.38)
  Top 0.254: U1.1 12.67,30.48 11.75,30.48 10.16,28.83 8.19,28.83 v7.87,28.89
  Bottom 0.254: DUART.2 3.81,43.81 3.49,43.5 3.49,33.66 3.81,33.34 3.81,30.16 5.08,28.89 v7.87,28.89
VDDA  (via drill 0.38)
  Top 0.254: U1.13 18.76,29.53 | 18.76,29.53 18.76,28.92 18.92,28.76 v18.92,28.32 19.3,27.94 20.07,27.94 20.57,27.43 E1.2 | U1.14 19.26,29.76 19.05,29.53 18.76,29.53 | v24,29.21 TVDA.P
  Bottom 0.254: v24,29.21 23.5,28.7 CB3.1 C5.1 20.83,27.81 20.45,28.19 19.18,28.19 19.05,28.32 v18.92,28.32
VO33  (via drill 0.38)
  Top 0.254: 15.75,29.21 15.75,30.56 U1.7
  Top 0.305: v15.56,28.89 15.56,29.02 15.75,29.21
  Bottom 0.305: 18.61,27.3 J2.1
  Bottom 0.508: CB2.1 C3.1 15.56,28.39 v15.56,28.89
  Bottom 0.61: C3.1 18.61,27.3
XTAL
  Top 0.254: U1.33 20.32,41.88 20.32,42.93 20.45,43.05 21.34,43.05 21.34,44.73 Y1.2 | 21.57,44.45 Y1.2 | 21.44,44.83 Y1.2
XTAL32
  Top 0.254: U1.19 23.7,33.45 X1.1

### Text on the board
tPlace: QB# | QB | QA# | QA | B | A | GND | +3.3V | 3.3V | PD7 | +3.3V | +5V | GND | TX | RX | RTS | PD6 | ENC485P1 | +5V | GND | A | B
bPlace: +3.3V | QDA | QDB | GND | +5V | GND | A | B